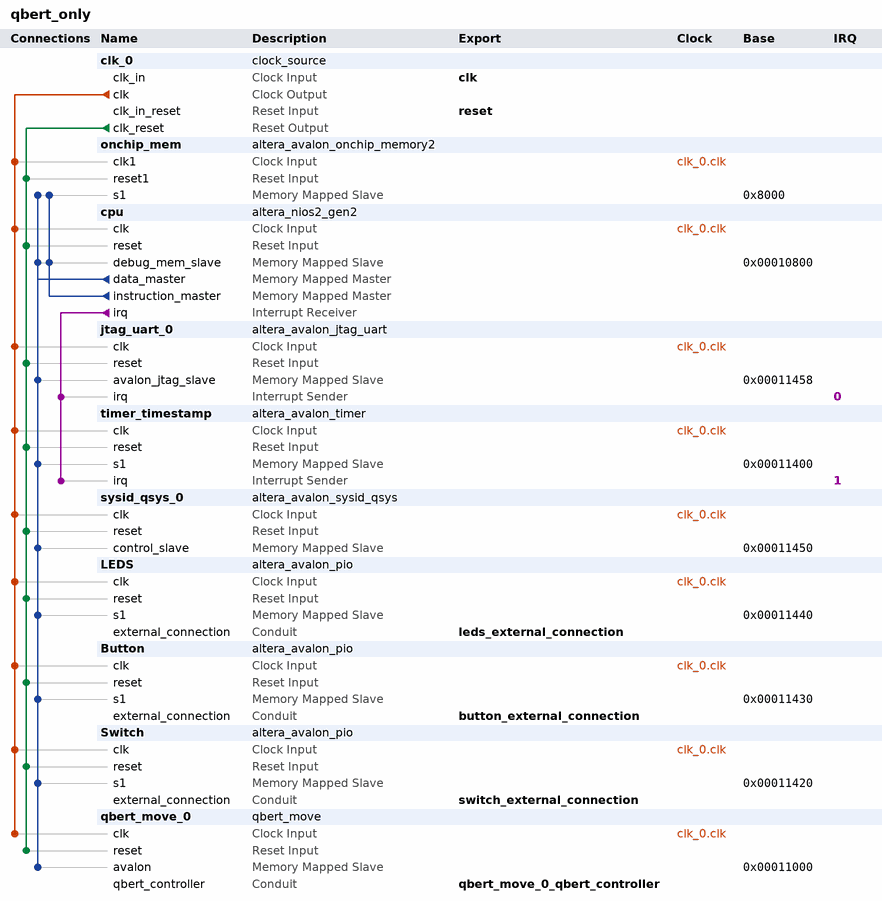
[diagram p0: system contents]
# Platform Designer (Qsys) system qbert_only, Cyclone IV E EP4CE22F17C6
# Parameters at their usual value, and those the tool derives, are not listed.
package require -exact qsys 15.0
create_system qbert_only
set_project_property DEVICE_FAMILY {Cyclone IV E}
set_project_property DEVICE EP4CE22F17C6

add_instance clk_0 clock_source 15.0
set_instance_parameter_value clk_0 clockFrequency 50000000

add_instance onchip_mem altera_avalon_onchip_memory2 15.0
set_instance_parameter_value onchip_mem dataWidth 32
set_instance_parameter_value onchip_mem dualPort false
set_instance_parameter_value onchip_mem initMemContent true
set_instance_parameter_value onchip_mem initializationFileName onchip_mem.hex
set_instance_parameter_value onchip_mem memorySize 20000

add_instance cpu altera_nios2_gen2 15.0
set_instance_parameter_value cpu dcache_size 2048
set_instance_parameter_value cpu exceptionSlave onchip_mem.s1
set_instance_parameter_value cpu icache_size 4096
set_instance_parameter_value cpu impl Tiny
set_instance_parameter_value cpu resetSlave onchip_mem.s1

add_instance jtag_uart_0 altera_avalon_jtag_uart 15.0
set_instance_parameter_value jtag_uart_0 simInteractiveOptions NO_INTERACTIVE_WINDOWS

add_instance timer_timestamp altera_avalon_timer 15.0
set_instance_parameter_value timer_timestamp period 1
set_instance_parameter_value timer_timestamp periodUnits MSEC

add_instance sysid_qsys_0 altera_avalon_sysid_qsys 15.0
set_instance_parameter_value sysid_qsys_0 id 0

add_instance LEDS altera_avalon_pio 15.0
set_instance_parameter_value LEDS direction Output
set_instance_parameter_value LEDS width 8

add_instance Button altera_avalon_pio 15.0
set_instance_parameter_value Button direction Input
set_instance_parameter_value Button width 1

add_instance Switch altera_avalon_pio 15.0
set_instance_parameter_value Switch direction Input
set_instance_parameter_value Switch width 4

add_instance qbert_move_0 qbert_move 1.0
set_instance_parameter_value qbert_move_0 H_LINE 1056
set_instance_parameter_value qbert_move_0 Horizontal_Blank 46
set_instance_parameter_value qbert_move_0 Horizontal_Front_Porch 210
set_instance_parameter_value qbert_move_0 V_LINE 525
set_instance_parameter_value qbert_move_0 Vertical_Blank 23
set_instance_parameter_value qbert_move_0 Vertical_Front_Porch 22

# connections
add_connection clk_0.clk Button.clk clock
add_connection clk_0.clk cpu.clk clock
add_connection clk_0.clk jtag_uart_0.clk clock
add_connection clk_0.clk LEDS.clk clock
add_connection clk_0.clk onchip_mem.clk1 clock
add_connection clk_0.clk qbert_move_0.clk clock
add_connection clk_0.clk Switch.clk clock
add_connection clk_0.clk sysid_qsys_0.clk clock
add_connection clk_0.clk timer_timestamp.clk clock
add_connection clk_0.clk_reset Button.reset reset
add_connection clk_0.clk_reset cpu.reset reset
add_connection clk_0.clk_reset jtag_uart_0.reset reset
add_connection clk_0.clk_reset LEDS.reset reset
add_connection clk_0.clk_reset onchip_mem.reset1 reset
add_connection clk_0.clk_reset qbert_move_0.reset reset
add_connection clk_0.clk_reset Switch.reset reset
add_connection clk_0.clk_reset sysid_qsys_0.reset reset
add_connection clk_0.clk_reset timer_timestamp.reset reset
add_connection cpu.data_master Button.s1 avalon
set_connection_parameter_value cpu.data_master/Button.s1 baseAddress 0x00011430
add_connection cpu.data_master cpu.debug_mem_slave avalon
set_connection_parameter_value cpu.data_master/cpu.debug_mem_slave baseAddress 0x00010800
add_connection cpu.data_master jtag_uart_0.avalon_jtag_slave avalon
set_connection_parameter_value cpu.data_master/jtag_uart_0.avalon_jtag_slave baseAddress 0x00011458
add_connection cpu.data_master LEDS.s1 avalon
set_connection_parameter_value cpu.data_master/LEDS.s1 baseAddress 0x00011440
add_connection cpu.data_master onchip_mem.s1 avalon
set_connection_parameter_value cpu.data_master/onchip_mem.s1 baseAddress 0x8000
add_connection cpu.data_master qbert_move_0.avalon avalon
set_connection_parameter_value cpu.data_master/qbert_move_0.avalon baseAddress 0x00011000
add_connection cpu.data_master Switch.s1 avalon
set_connection_parameter_value cpu.data_master/Switch.s1 baseAddress 0x00011420
add_connection cpu.data_master sysid_qsys_0.control_slave avalon
set_connection_parameter_value cpu.data_master/sysid_qsys_0.control_slave baseAddress 0x00011450
add_connection cpu.data_master timer_timestamp.s1 avalon
set_connection_parameter_value cpu.data_master/timer_timestamp.s1 baseAddress 0x00011400
add_connection cpu.instruction_master cpu.debug_mem_slave avalon
set_connection_parameter_value cpu.instruction_master/cpu.debug_mem_slave baseAddress 0x00010800
add_connection cpu.instruction_master onchip_mem.s1 avalon
set_connection_parameter_value cpu.instruction_master/onchip_mem.s1 baseAddress 0x8000
add_connection cpu.irq jtag_uart_0.irq interrupt
set_connection_parameter_value cpu.irq/jtag_uart_0.irq irqNumber 0
add_connection cpu.irq timer_timestamp.irq interrupt
set_connection_parameter_value cpu.irq/timer_timestamp.irq irqNumber 1

# exported interfaces
add_interface button_external_connection conduit end
set_interface_property button_external_connection EXPORT_OF Button.external_connection
add_interface clk clock sink
set_interface_property clk EXPORT_OF clk_0.clk_in
add_interface leds_external_connection conduit end
set_interface_property leds_external_connection EXPORT_OF LEDS.external_connection
add_interface qbert_move_0_qbert_controller conduit end
set_interface_property qbert_move_0_qbert_controller EXPORT_OF qbert_move_0.qbert_controller
add_interface reset reset sink
set_interface_property reset EXPORT_OF clk_0.clk_in_reset
add_interface switch_external_connection conduit end
set_interface_property switch_external_connection EXPORT_OF Switch.external_connection

set_interconnect_requirement {$system} qsys_mm.clockCrossingAdapter HANDSHAKE
set_interconnect_requirement {$system} qsys_mm.enableEccProtection FALSE
set_interconnect_requirement {$system} qsys_mm.insertDefaultSlave FALSE
set_interconnect_requirement {$system} qsys_mm.maxAdditionalLatency 1

save_system qbert_only.qsys
